# Altium schematic sheet MainPowerCircuit.SchDoc
size A4; SheetNumber: 1; SheetTotal: 5
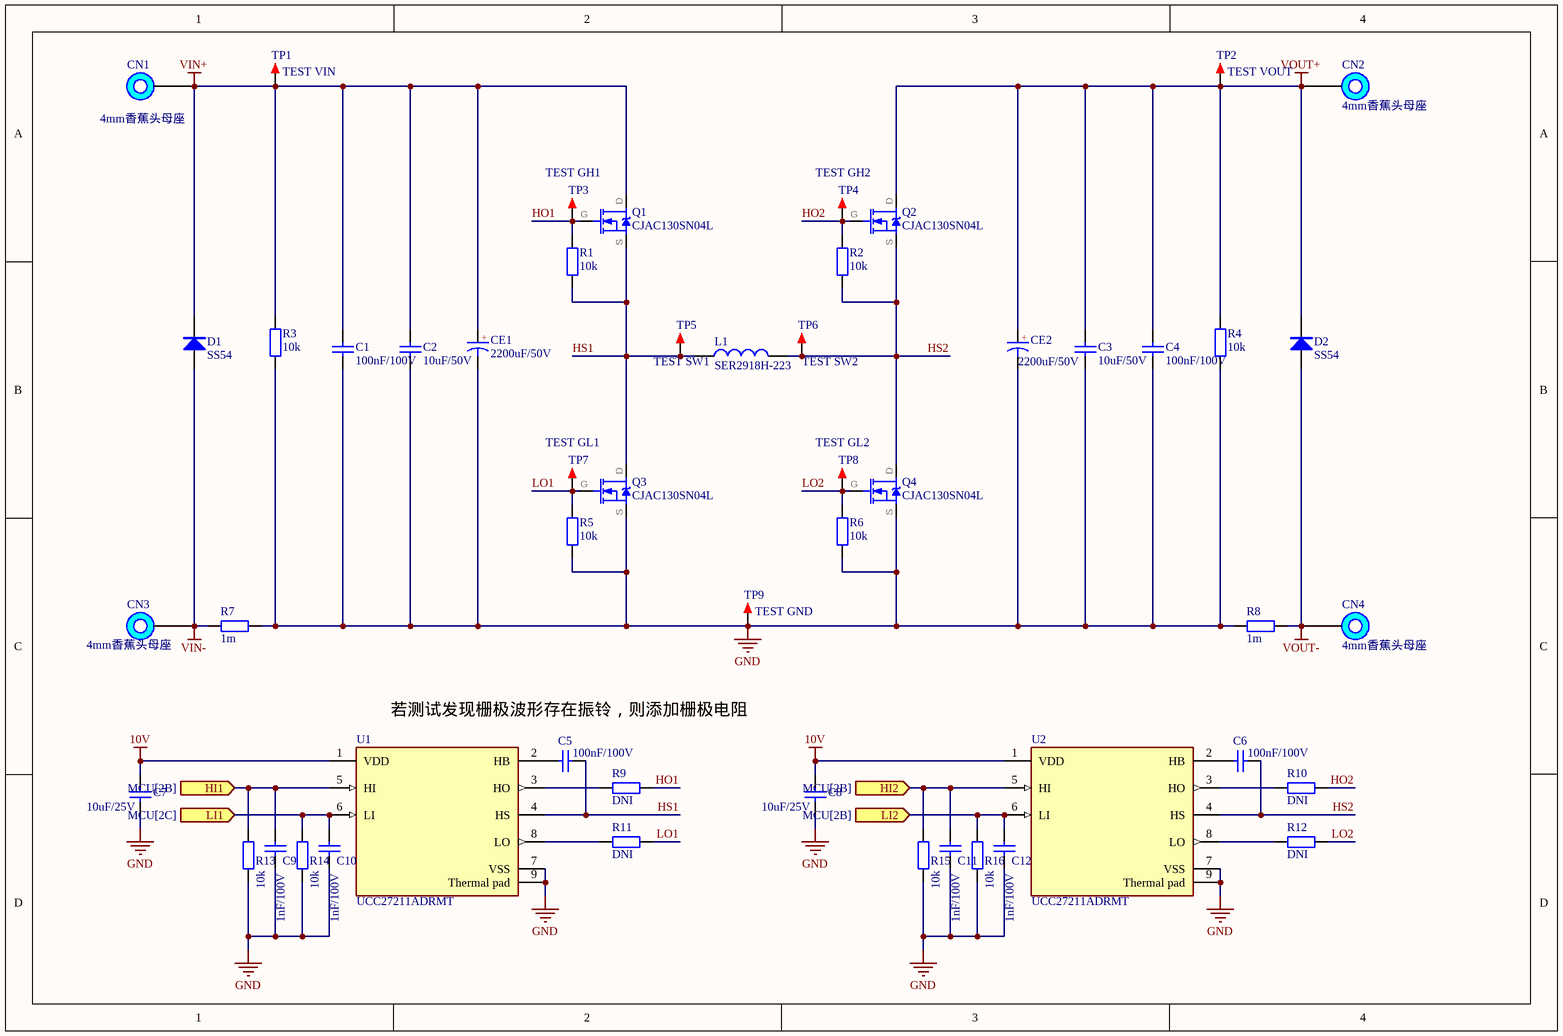
[diagram p0: MainPowerCircuit.SchDoc]

## Parts
C1  100nF/100V  [C0402_L]
C2  10uF/50V  [C1206_L]
C3  10uF/50V  [C1206_L]
C4  100nF/100V  [C0402_L]
C5  100nF/100V  [C0402_L]
C6  100nF/100V  [C0402_L]
C7  10uF/25V  [C0603_L]
C8  10uF/25V  [C0603_L]
C9  1nF/100V  [C0402_L]
C10  1nF/100V  [C0402_L]
C11  1nF/100V  [C0402_L]
C12  1nF/100V  [C0402_L]
CE1  2200uF/50V  [CE-7.5*16*31.5 - GD]
CE2  2200uF/50V  [CE-7.5*16*31.5 - GD]
CN1  4mm香蕉头母座  [4mm香蕉头母座]
CN2  4mm香蕉头母座  [4mm香蕉头母座]
CN3  4mm香蕉头母座  [4mm香蕉头母座]
CN4  4mm香蕉头母座  [4mm香蕉头母座]
D1  SS54  [SMA]
D2  SS54  [SMA]
L1  SER2918H-223  [SER2918H-223]
Q1  CJAC130SN04L  [PDFNWB5×6-8L]
Q2  CJAC130SN04L  [PDFNWB5×6-8L]
Q3  CJAC130SN04L  [PDFNWB5×6-8L]
Q4  CJAC130SN04L  [PDFNWB5×6-8L]
R1  10k  [R 0402_L]
R2  10k  [R 0402_L]
R3  10k  [R 0402_L]
R4  10k  [R 0402_L]
R5  10k  [R 0402_L]
R6  10k  [R 0402_L]
R7  1m  [R2512_L]
R8  1m  [R2512_L]
R9  DNI  [R 0402_L]
R10  DNI  [R 0402_L]
R11  DNI  [R 0402_L]
R12  DNI  [R 0402_L]
R13  10k  [R 0402_L]
R14  10k  [R 0402_L]
R15  10k  [R 0402_L]
R16  10k  [R 0402_L]
TP1  TEST VIN  [TEST TP1.4_W]
TP2  TEST VOUT  [TEST TP1.4_W]
TP3  TEST GH1  [TEST TP1.4_W]
TP4  TEST GH2  [TEST TP1.4_W]
TP5  TEST SW1  [TEST TP1.4_W]
TP6  TEST SW2  [TEST TP1.4_W]
TP7  TEST GL1  [TEST TP1.4_W]
TP8  TEST GL2  [TEST TP1.4_W]
TP9  TEST GND  [TEST TP1.4_W]
U1  UCC27211ADRMT  [FP-DRM0008A-MFG]
U2  UCC27211ADRMT  [FP-DRM0008A-MFG]

## Ports
HI1 (in, see MCU[2B]), HI2 (in, see MCU[2B]), LI1 (in, see MCU[2C]), LI2 (in, see MCU[2B])

## Nets
10V: C7.2 C8.2 U1.1(VDD) U2.1(VDD)
GND: C1.1 C2.1 C3.1 C4.1 C7.1 C8.1 C9.2 C10.2 C11.2 C12.2 CE1.2 CE2.2 Q3.S Q4.S R3.1 R4.1 R5.1 R6.1 R7.2 R8.1 R13.1 R14.1 R15.1 R16.1 TP9.1 U1.7(VSS) U1.9(Thermal_pad) U2.7(VSS) U2.9(Thermal_pad)
VIN+: C1.2 C2.2 CE1.1 CN1.1 D1.2(K) Q1.D R3.2 TP1.1
VIN-: CN3.1 D1.1(A) R7.1
VOUT+: C3.2 C4.2 CE2.1 CN2.1 D2.2(K) Q2.D R4.2 TP2.1
VOUT-: CN4.1 D2.1(A) R8.2
HI1: C9.1 R13.2 U1.5(HI) ; port HI1
HI2: C11.1 R15.2 U2.5(HI) ; port HI2
HO1: Q1.G R1.2 R9.1 TP3.1
HO2: Q2.G R2.2 R10.1 TP4.1
HS1: C5.1 L1.1 Q1.S Q3.D R1.1 TP5.1 U1.4(HS)
HS2: C6.1 L1.2 Q2.S Q4.D R2.1 TP6.1 U2.4(HS)
LI1: C10.1 R14.2 U1.6(LI) ; port LI1
LI2: C12.1 R16.2 U2.6(LI) ; port LI2
LO1: Q3.G R5.2 R11.1 TP7.1
LO2: Q4.G R6.2 R12.1 TP8.1
NetC5_2: C5.2 U1.2(HB)
NetC6_2: C6.2 U2.2(HB)
NetR9_2: R9.2 U1.3(HO)
NetR10_2: R10.2 U2.3(HO)
NetR11_2: R11.2 U1.8(LO)
NetR12_2: R12.2 U2.8(LO)

## Notes on the sheet
- 若测试发现栅极波形存在振铃，则添加栅极电阻
- (in symbol CE) +

## Library data of the parts
C1-C12 = C: 贴片电容; BOM名称: 无极性贴片电容; 联系卖家，免费查找封装: 唯一出售店铺网址https://shop463601444.taobao.com
CE1 CE2 = CE: 直插电解电容; 联系卖家，免费查找封装: 唯一出售店铺网址https://shop463601444.taobao.com; BOM名称: 直插电解电容
D1 D2 = SS14: 肖特基二极管; 版权归属: 源创客; 属性: 40V/1A; BOM名称: 肖特基二极管; 学习资源: www.ooocke.com
L1 = L: 大电流扁平线电感
Q1-Q4 = CJAC130SN04L: 130A 40V 2.0mΩ@10V N-Channel Power MOSFET
R1-R6 R9-R16 = R: 贴片电阻; 版权归属: 源创客; BOM名称: 贴片电阻; 学习资源: www.ooocke.com
R7 R8 = R: 贴片电阻; 联系卖家，免费查找封装: 唯一出售店铺网址https://shop463601444.taobao.com; BOM名称: 贴片电阻
TP1-TP9 = TEST TP: 测试环; 联系卖家，免费查找封装: 唯一出售店铺网址https://shop463601444.taobao.com; 封装库来自淘宝卖家ID：黄晶宝石: 其他店铺购入均为盗版假冒封装库，请立即申请退款; BOM名称: 测试环
U1 U2 = CMP-2000-07521-2: IC GATE DRVR HALF-BRIDGE 8VSON; Number of Drivers: 2; Number of Outputs: 1; Turn-Off Delay Time: 17ns; Nominal Supply Current: 2.6mA; Max Output Current: 4A; Rise Time: 7.2ns; Channel Type: Independent; Element Configuration: Dual; Max Supply Voltage: 17V; Fall Time: 5.5ns; Max Supply Current: 6.5mA; Min Supply Voltage: 8V; Number of Pins: 8; Radiation Hardening: No; Packaging: Tape and Reel; REACH SVHC: No SVHC; Max Operating Temperature: 140°C; Number of Channels: 2; Min Operating Temperature: -40°C; Turn-On Delay Time: 17ns; RoHS Compliant: Yes; Lead Free: Lead Free; Output Current: 4A; Package Quantity: 250; Mount: Surface Mount